# EAGLE design Laser_Terminal (EAGLE 9.2.0)
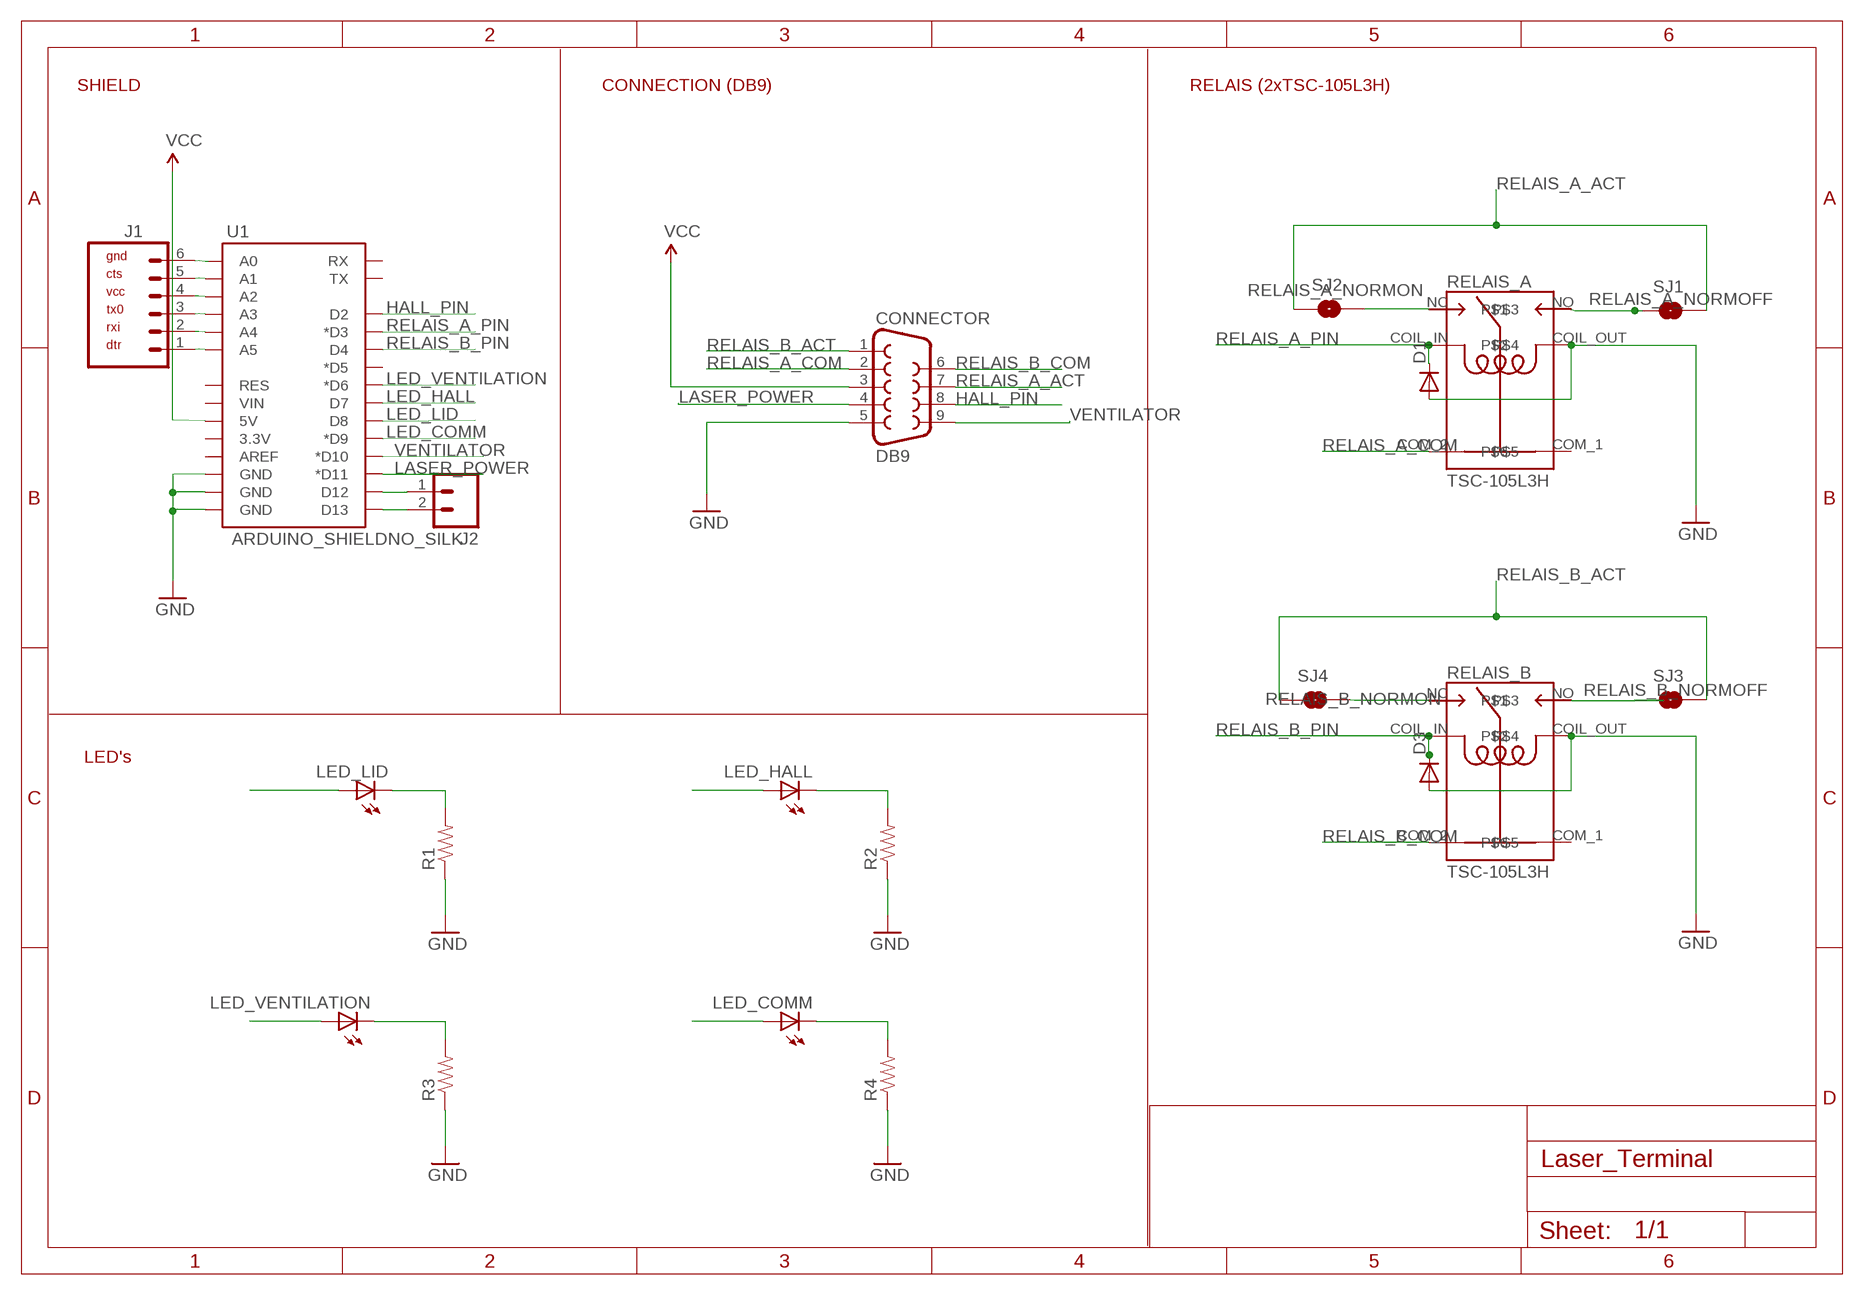
[diagram p0: schematic, sheet 1]

## Parts
CONNECTOR  DB9  DB9MALE  [DB9_MALE]
D1  DIODEPTH  [DIODE-1N4001]
D3  DIODEPTH  [DIODE-1N4001]
J1  M06NO_SILK_YES_STOP  [1X06_NO_SILK_YES_STOP]
J2  M021X02_NO_SILK  [1X02_NO_SILK]
LED_COMM  LED5MM  [LED5MM]
LED_HALL  LED5MM  [LED5MM]
LED_LID  LED5MM  [LED5MM]
LED_VENTILATION  LED5MM  [LED5MM]
R1  RESISTORAXIAL-0.3  [AXIAL-0.3]
R2  RESISTORAXIAL-0.3  [AXIAL-0.3]
R3  RESISTORAXIAL-0.3  [AXIAL-0.3]
R4  RESISTORAXIAL-0.3  [AXIAL-0.3]
RELAIS_A  TSC-105L3H  TSC-112L3H  [TSC_112L3H]
RELAIS_B  TSC-105L3H  TSC-112L3H  [TSC_112L3H]
SJ1  SOLDERJUMPERNO  [SJ_2S-NO]
SJ2  SOLDERJUMPERTRACE  [SJ_2S-TRACE]
SJ3  SOLDERJUMPERNO  [SJ_2S-NO]
SJ4  SOLDERJUMPERTRACE  [SJ_2S-TRACE]
U1  ARDUINO_SHIELDNO_SILK  [DUEMILANOVE_VIAS]

## Nets
GND: CONNECTOR.5 D1.A D3.A R1.P$1 R2.P$1 R3.P$1 R4.P$1 RELAIS_A.COIL_OUT RELAIS_B.COIL_OUT U1.GND@0(GND) U1.GND@1(GND) U1.GND@2(GND)
HALL_PIN: CONNECTOR.8 U1.D2
LASER_POWER: CONNECTOR.4 U1.D11(*D11)
LED_COMM: LED_COMM.A U1.D9(*D9)
LED_HALL: LED_HALL.A U1.D7
LED_LID: LED_LID.A U1.D8
LED_VENTILATION: LED_VENTILATION.A U1.D6(*D6)
N$3: J1.6 U1.A0
N$4: J1.5 U1.A1
N$5: J1.4 U1.A2
N$6: J1.3 U1.A3
N$7: LED_LID.K(C) R1.P$2
N$8: LED_HALL.K(C) R2.P$2
N$9: LED_VENTILATION.K(C) R3.P$2
N$10: LED_COMM.K(C) R4.P$2
N$11: J1.2 U1.A4
N$12: J1.1 U1.A5
N$13: J2.1 U1.D12
N$14: J2.2 U1.D13
RELAIS_A_ACT: CONNECTOR.7 SJ1.2 SJ2.1
RELAIS_A_COM: CONNECTOR.2 RELAIS_A.COM_2
RELAIS_A_NORMOFF: RELAIS_A.NO SJ1.1
RELAIS_A_NORMON: RELAIS_A.NC SJ2.2
RELAIS_A_PIN: D1.C RELAIS_A.COIL_IN U1.D3(*D3)
RELAIS_B_ACT: CONNECTOR.1 SJ3.2 SJ4.1
RELAIS_B_COM: CONNECTOR.6 RELAIS_B.COM_2
RELAIS_B_NORMOFF: RELAIS_B.NO SJ3.1
RELAIS_B_NORMON: RELAIS_B.NC SJ4.2
RELAIS_B_PIN: D3.C RELAIS_B.COIL_IN U1.D4
VCC: CONNECTOR.3 U1.5V
VENTILATOR: CONNECTOR.9 U1.D10(*D10)
Unconnected: RELAIS_A.COM_1 RELAIS_B.COM_1 U1.3.3V U1.AREF U1.D5(*D5) U1.RES U1.RX U1.TX U1.VIN

## Notes on the sheet
- SHIELD | CONNECTION (DB9) | RELAIS (2xTSC-105L3H)
- LED's

## Library data of the parts
CONNECTOR = SparkFun:DB9: DB9 Connector Standard DB9 (D-Sub 9) serial connector. Can be used for CAN bus as well as RS485 and RS232. Footprint production proven. Spark Fun Electronics SKU : PRT-00429
D1 D3 = SparkFun:DIODE: Diode These are standard reverse protection diodes and small signal diodes. SMA package can handle up to about 1A. SOD-323 can handle about 200mA. What the SOD-323 package when ordering, there are some mfgs out there that are 5-pin packages.
J1 = SparkFun-Connectors:M06: Header 6 Standard 6-pin 0.1" header. Use with straight break away headers (SKU : PRT-00116), right angle break away headers (PRT-00553), swiss pins (PRT-00743), machine pins (PRT-00117), and female headers (PRT-00115). Molex polarized connector foot print use with SKU : PRT-08094 with associated crimp pins and housings. NOTES ON THE VARIANTS LOCK and LOCK_LONGPADS... This footprint was designed to help hold the alignment of a through-hole component (i.e. 6-pin header) while soldering it into place. You may notice that each hole has been shifted either up or down by 0.005 of an inch from it's more standard position (which is a perfectly straight line). This slight alteration caused the pins (the squares in the middle) to touch the edges of the holes. Because they are alternating, it causes a "brace" to hold the component in place. 0.005 has proven to be the perfect amount of "off-center" position when using our standard breakaway headers. Although looks a little odd when you look at the bare footprint, once you have a header in there, the alteration is very hard to notice. Also,if you push a header all the way into place, it is covered up entirely on the bottom side. This idea of altering the position of holes to aid alignment will be further integrated into the Sparkfun Library for other footprints. It can help hold any component with 3 or more connection pins.
J2 = SparkFun-Connectors:M02: Standard 2-pin 0.1" header. Use with - straight break away headers ( PRT-00116) - right angle break away headers (PRT-00553) - swiss pins (PRT-00743) - machine pins (PRT-00117) - female headers (PRT-00115) Molex polarized connector foot print use with: PRT-08233 with associated crimp pins and housings. 2.54_SCREWTERM for use with PRT-10571. 3.5mm Screw Terminal footprints for PRT-08084 5mm Screw Terminal footprints for use with PRT-08432
LED_COMM LED_HALL LED_LID LED_VENTILATION = SparkFun:LED: LEDs Standard schematic elements and footprints for 5mm, 3mm, 1206, and 0603 sized LEDs. 5mm - Spark Fun Electronics SKU : COM-00529 (and others)
R1-R4 = SparkFun:RESISTOR: Resistor Basic schematic elements and footprints for 0603, 1206, and PTH resistors.
RELAIS_A RELAIS_B = Custom:TSC-112L3H
SJ1-SJ4 = RP400N501A:SOLDERJUMPER: Solder Jumper Standard SMD solder jumper. Used to automate production. Two varients : Normally Open and Normally Closed are the same, but have different paste layers. NC will have a large amount of paste and should jumper during reflow.
U1 = SparkFun:ARDUINO_SHIELD

## Board
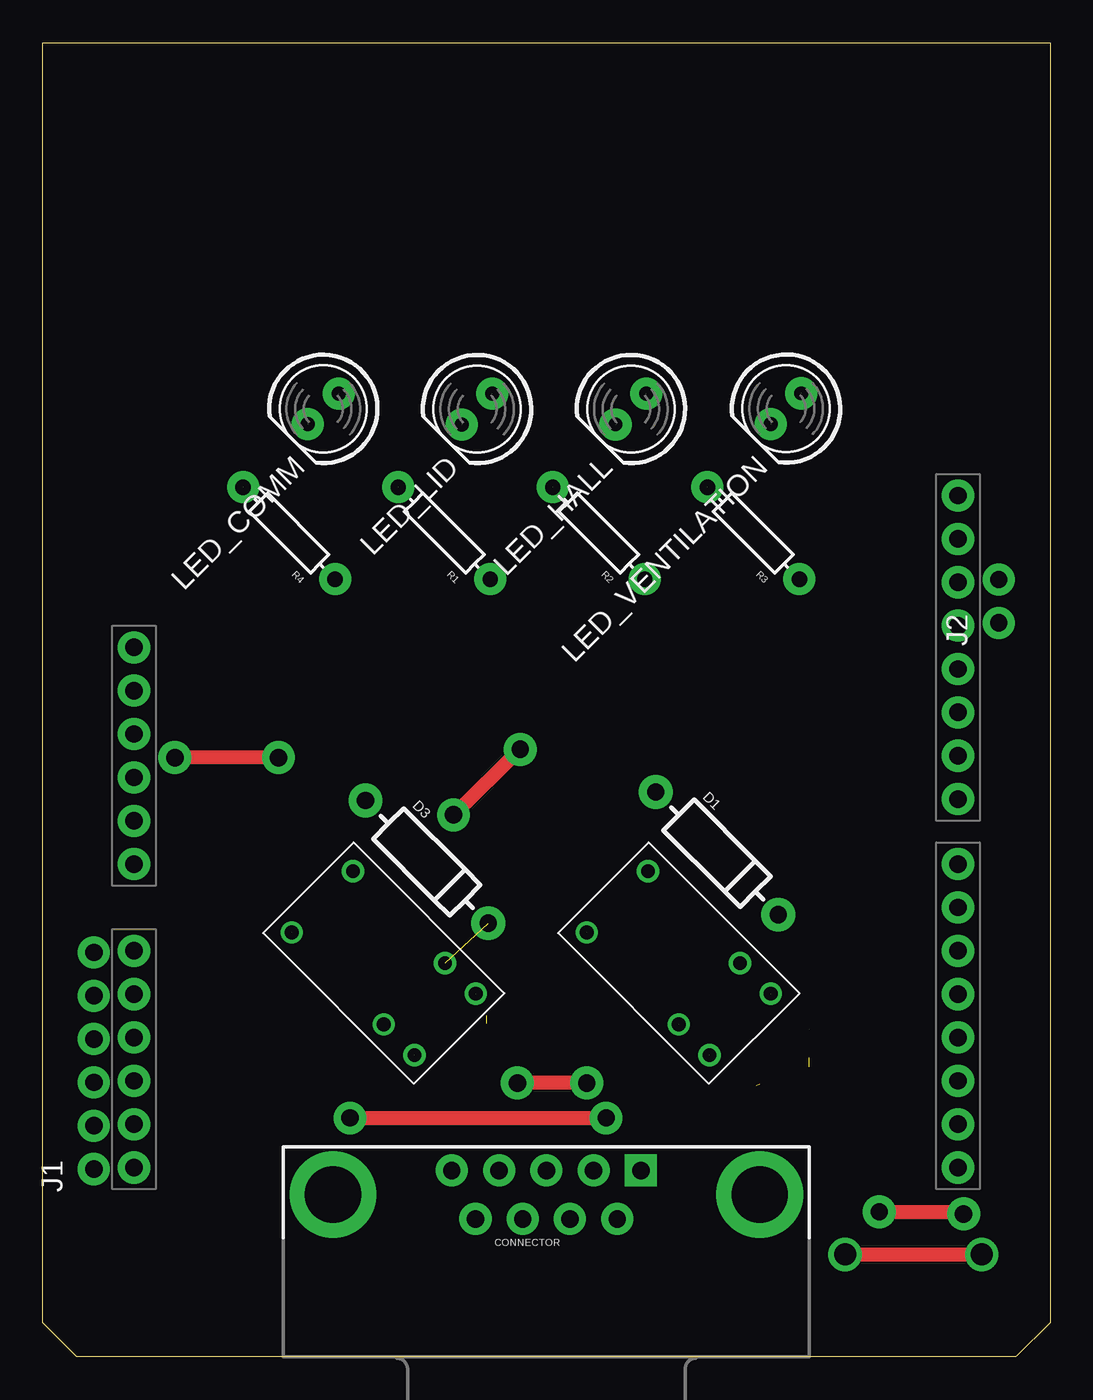
[diagram p1: board, top side]
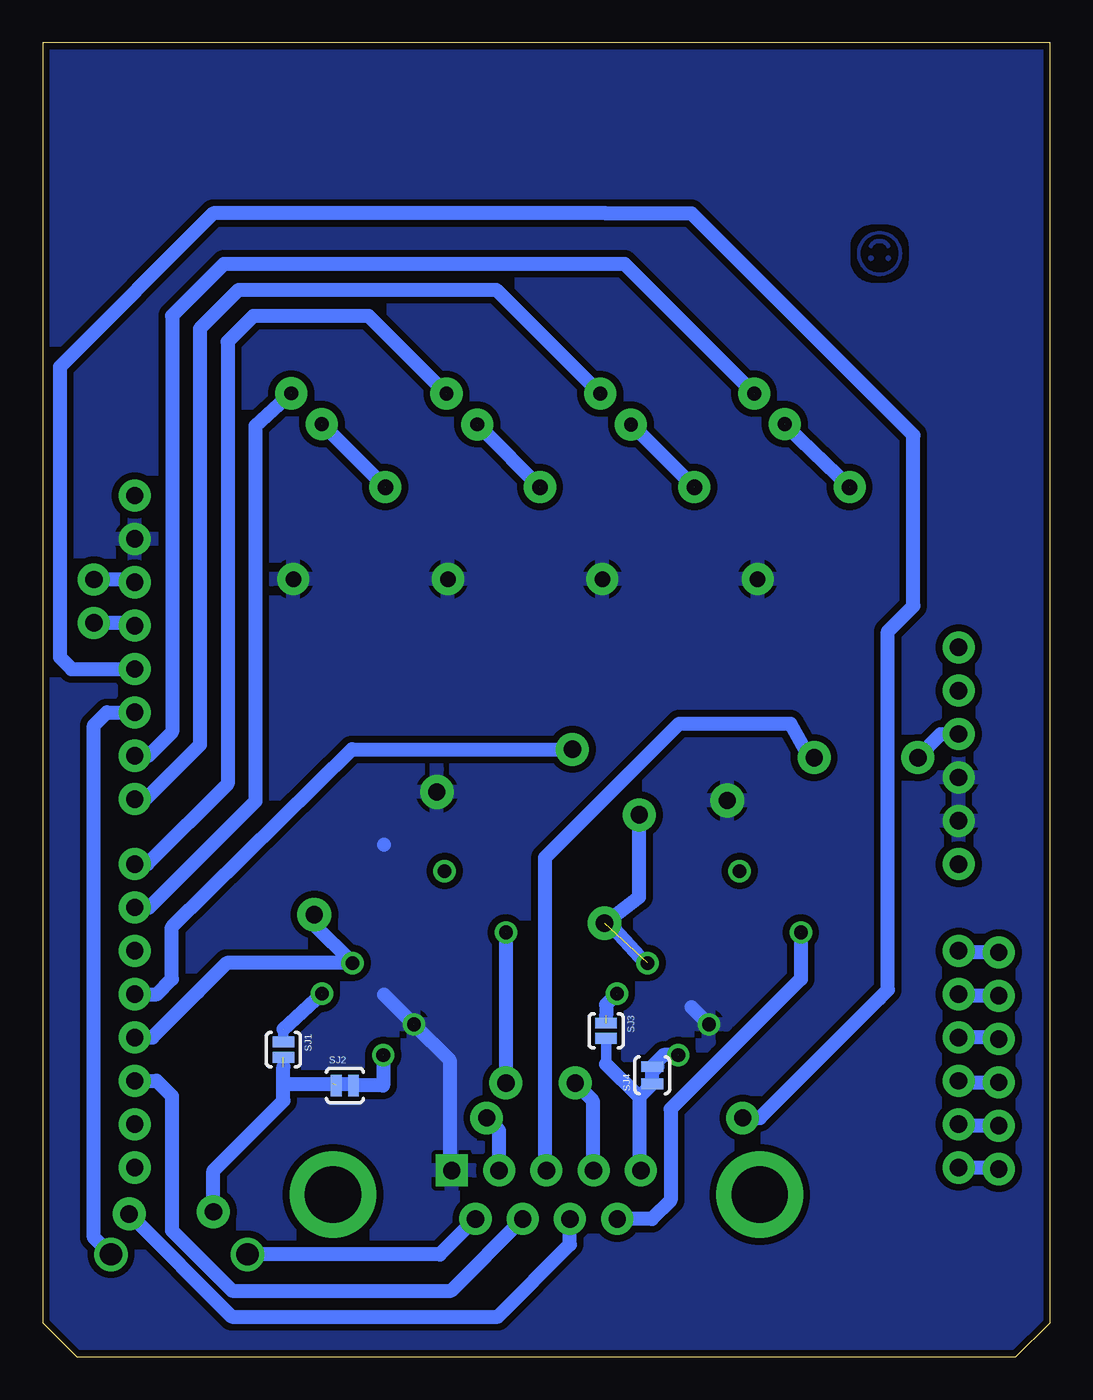
[diagram p2: board, bottom side, seen from below]

Size 59 x 77 mm. Coordinates in mm from the lower left corner, seen from the top.
Outline: 59,2 57,0 2,0 0,2 0,77 59,77 59,2
Copper layers (1*16): Top 0.035mm / dielectric 1.5mm / Bottom 0.035mm
Design rules "SparkFun-2-layer-STANDARD": minimum track width 10mil, minimum drill 20mil, track to track 10mil, track to pad 8mil, pad to pad 8mil, via to via 10mil, smd to smd 8mil, copper to edge 8mil, drill to drill 8mil, minimum pad ring 10mil, minimum via ring 10mil, stop-mask expansion 4mil, vias tented up to drill 25mil, thermal gap 10mil

### Footprints (pad centres in the part's own frame; a part is rotated, then mirrored left to right if it is on the bottom)
DB9_MALE = drill 1.016 pad 1.88: 1 5.54,-1.42; 2 2.77,-1.42; 3 0,-1.42; 4 -2.77,-1.42; 6 4.15,1.42; 7 1.38,1.42; 8 -1.38,1.42; 9 -4.15,1.42 | drill 1.016 pad 1.88 square: 5 -5.54,-1.42 | drill 3.302 pad 5.08: G1 -12.5,0; G2 12.5,0
DIODE-1N4001 = drill 1 pad 1.981: A -5.08,0; C 5.08,0
1X06_NO_SILK_YES_STOP = drill 1.016 pad 1.88: 1 0,0; 2 2.54,0; 3 5.08,0; 4 7.62,0; 5 10.16,0; 6 12.7,0
1X02_NO_SILK = drill 1.016 pad 1.88: 1 0,0; 2 2.54,0
LED5MM = drill 0.813 pad 1.88: A -1.27,0; K 1.27,0
AXIAL-0.3 = drill 0.9 pad 1.88: P$1 -3.81,0; P$2 3.81,0
TSC_112L3H = drill 0.8: COIL_IN 1.21,8.79; COIL_OUT 6.29,8.79; COM_1 1.21,1.17; COM_2 6.29,1.17; NC 6.29,11.33; NO 1.21,11.33
SJ_2S-NO = smd 0.635 x 1.27: 1 -0.45,0; 2 0.45,0
SJ_2S-TRACE = smd 0.635 x 1.27: 1 -0.508,0; 2 0.508,0
DUEMILANOVE_VIAS = drill 1.016 pad 1.88: 3.3V 50.8,13.97; 5V 50.8,16.51; A0 50.8,29.21; A1 50.8,31.75; A2 50.8,34.29; A3 50.8,36.83; A4 50.8,39.37; A5 50.8,41.91; AREF 2.54,2.54; D2 2.54,36.83; D3 2.54,34.29; D4 2.54,31.75; D5 2.54,29.21; D6 2.54,26.67; D7 2.54,24.13; D8 2.54,20.32; D9 2.54,17.78; D10 2.54,15.24; D11 2.54,12.7; D12 2.54,10.16; D13 2.54,7.62; GND@0 50.8,19.05; GND@1 50.8,21.59; GND@2 2.54,5.08; RES 50.8,11.43; RX 2.54,41.91; TX 2.54,39.37; VIN 50.8,24.13

### Placement (x,y rotation side)
CONNECTOR  29.5,9.5 180 top
D1  39.5,29.5 315 top
D3  22.5,29 315 top
J1  3,11 90 top
J2  56,43 90 top
LED_COMM  16.43,55.54 225 top
LED_HALL  34.45,55.53 225 top
LED_LID  25.44,55.53 225 top
LED_VENTILATION  43.54,55.56 225 top
R1  23.52,48.26 135 top
R2  32.57,48.26 135 top
R3  41.62,48.26 135 top
R4  14.43,48.26 135 top
RELAIS_A  35.49,30.14 225 top
RELAIS_B  18.21,30.14 225 top
SJ1  44.9,18 270 bottom
SJ2  41.3,15.9 0 bottom
SJ3  26,19.1 270 bottom
SJ4  23.3,16.5 90 bottom
U1  56.15,53 180 top

### Tracks (layer width: path | path; a pad name or v marks a point on that pad's centre or on a via)
GND  (1 unrouted)
  Bottom 0.813: RELAIS_A.COIL_OUT 37.26,19.4 | CONNECTOR.5 35.17,11.05 35.17,17.39 RELAIS_A.COIL_OUT | RELAIS_A.COIL_OUT 39,21.22 | RELAIS_B.COIL_OUT 21,20.5 | 39,30
  pour Bottom (isolate 0.4, rank 3): 57,0 0,0 0,77 59,77 59,0
HALL_PIN
  Bottom 0.813: U1.D2 52.32,16.17 51.43,15.28 51.43,7.4 47.9,3.88 35.08,3.88 CONNECTOR.8
LASER_POWER  (via drill 1 pad 1.9)
  Top 0.813: v18,14 v33,14
  Bottom 0.813: CONNECTOR.4 32.27,13.27 v33,14 | v18,14 17,14 10,21 9.5,21.5 9.5,42.5 8,44 8,54 9.5,55.5 21,67 26,67 49,67 58,58 58,41 57.3,40.3 U1.D11
LED_COMM  (1 unrouted)
  Bottom 0.813: U1.D9 52.81,35.22 51.42,36.61 51.42,61 48.37,64.05 24.94,64.05 LED_COMM.A
LED_HALL  (1 unrouted)
  Bottom 0.813: U1.D7 52.87,28.87 48.17,33.57 48.17,59.47 46.65,61 39.92,61 LED_HALL.A
LED_LID  (1 unrouted)
  Bottom 0.813: U1.D8 52.97,32.68 49.8,35.85 49.8,60.24 47.51,62.52 32.43,62.52 LED_LID.A
LED_VENTILATION  (1 unrouted)
  Bottom 0.813: U1.D6 52.77,26.33 46.55,32.55 46.55,54.55 LED_VENTILATION.A
N$2
  Bottom 0.813: 23.57,23.07 23.71,23.07 26.13,25.74
N$3
  Bottom 0.813: J1.6 5.26,23.7 U1.A0
N$4
  Bottom 0.813: J1.5 5.26,21.16 U1.A1
N$5
  Bottom 0.813: J1.4 3.09,18.71 U1.A2
N$6
  Bottom 0.813: U1.A3 5.26,16.08 J1.3
N$7  (2 unrouted)
  Bottom 0.813: LED_LID.K 24.38,54.51 R1.P$2
N$8  (2 unrouted)
  Bottom 0.813: LED_HALL.K 33.3,54.38 R2.P$2
N$9  (2 unrouted)
  Bottom 0.813: LED_VENTILATION.K 42.38,54.4 R3.P$2
N$10  (2 unrouted)
  Bottom 0.813: LED_COMM.K 15.41,54.5 R4.P$2
N$11
  Bottom 0.813: J1.2 5.26,13.54 U1.A4
N$12
  Bottom 0.813: U1.A5 3.09,11.09 J1.1
N$13
  Bottom 0.813: U1.D12 53.77,43 J2.1
N$14
  Bottom 0.813: U1.D13 53.77,45.54 J2.2
RELAIS_A_ACT  (via drill 1.02 pad 1.93)  (2 unrouted)
  Top 0.813: v49,8.5 53.81,8.5 v53.94,8.37
  Bottom 0.813: CONNECTOR.7 28.12,6.58 32.35,2.36 47.92,2.36 v53.94,8.37 | 44.9,16 44.9,15 49,10.9 v49,8.5 | 44.9,16 42,16 | 44.9,16 44.9,17 | SJ2.1 41.71,16 41,16
RELAIS_A_COM  (via drill 1.02 pad 1.93)  (1 unrouted)
  Top 0.813: v31.87,16.04 | v31.87,16.04 v27.81,16.04
  Bottom 0.813: RELAIS_A.COM_2 v31.87,16.04 | v27.81,16.04 26.79,15.02 26.79,10.98 CONNECTOR.2
RELAIS_A_NORMOFF  (2 unrouted)
  Bottom 0.61: 44.73,19.36 44.9,19.19 SJ1.1
  Bottom 0.813: RELAIS_A.NO 44.9,19.2
RELAIS_A_NORMON  (1 unrouted)
  Bottom 0.813: RELAIS_A.NC 39.05,15.9 SJ2.2
RELAIS_A_PIN
  Bottom 0.813: U1.D3 52.57,18.71 49.9,21.37 48.21,23.07 RELAIS_A.COIL_IN 43.09,25.31 D1.C
RELAIS_B_ACT
  Bottom 0.61: 26,17.15 SJ3.2
  Bottom 0.813: CONNECTOR.1 24.07,10.96 24.07,15.22 | 24.07,15.22 SJ4.1 23.3,16.7 23,17 | 24.07,15.22 26,17.15
RELAIS_B_COM  (1 unrouted)
  Bottom 0.813: CONNECTOR.6 23.32,8.08 22.22,9.18 22.22,14.52 14.6,22.14 RELAIS_B.COM_2
RELAIS_B_NORMOFF  (2 unrouted)
  Bottom 0.813: RELAIS_B.NO 26,20.64 26,20
RELAIS_B_NORMON  (1 unrouted)
  Bottom 0.813: RELAIS_B.NC 22.63,17.68 SJ4.2
RELAIS_B_PIN  (via drill 1.02 pad 1.93)  (1 unrouted)
  Top 0.813: v27.97,35.6 v24.06,31.76
  Bottom 0.813: U1.D4 52.31,21.25 51.43,22.14 51.43,25.18 40.89,35.6 v27.97,35.6 | D3.C 24.06,26.94 v24.06,31.76
TEST
  pour Bottom (no thermals): 9.98,65.29 10.13,65.27 10.26,65.22 10.37,65.13 10.46,65 10.49,65.01 10.53,65.03 10.56,65.05 10.59,65.07 10.53,65.16 10.47,65.24 10.41,65.31 10.34,65.37 10.26,65.41 10.17,65.45 10.08,65.47 9.98,65.47 9.88,65.47 9.79,65.45 9.71,65.41 9.63,65.37 9.56,65.31 9.49,65.24 9.43,65.16 9.37,65.07 9.41,65.05 9.44,65.03 9.47,65.01 9.5,65 9.59,65.13 9.7,65.22 9.83,65.27
  pour Bottom (no thermals): 10.37,64.49 10.33,64.44 10.32,64.37 10.33,64.31 10.37,64.25 10.42,64.22 10.49,64.21 10.55,64.22 10.61,64.25 10.64,64.31 10.66,64.37 10.64,64.44 10.61,64.49 10.55,64.53 10.49,64.54 10.42,64.53
  pour Bottom (no thermals): 9.05,63.71 9.14,63.63 9.24,63.55 9.35,63.49 9.45,63.44 9.56,63.39 9.68,63.36 9.8,63.34 9.93,63.33 9.93,63.36 9.93,63.38 9.93,63.4 9.93,63.43 9.93,63.45 9.93,63.48 9.93,63.5 9.93,63.52 9.82,63.53 9.72,63.55 9.62,63.58 9.53,63.61 9.43,63.66 9.35,63.71 9.26,63.78 9.18,63.85 9.11,63.93 9.04,64.02 8.98,64.12 8.94,64.21 8.9,64.32 8.88,64.42 8.86,64.53 8.86,64.65 8.86,64.76 8.88,64.87 8.9,64.98 8.94,65.08 8.98,65.17 9.04,65.27 9.11,65.36 9.18,65.44 9.27,65.52 9.36,65.59 9.45,65.64 9.55,65.69 9.65,65.72 9.76,65.75 9.87,65.77 9.98,65.77 10.1,65.77 10.21,65.75 10.31,65.72 10.41,65.69 10.51,65.64 10.61,65.59 10.69,65.52 10.78,65.44 10.86,65.36 10.92,65.27 10.98,65.17 11.03,65.08 11.06,64.98 11.09,64.87 11.1,64.76 11.11,64.65 11.1,64.53 11.09,64.42 11.06,64.32 11.03,64.21 10.98,64.12 10.92,64.02 10.86,63.93 10.78,63.85 10.69,63.77 10.61,63.7 10.51,63.65 10.41,63.6 10.31,63.57 10.21,63.54 10.1,63.52 9.98,63.52 9.98,63.52 9.97,63.52 9.96,63.52 9.96,63.52 9.95,63.52 9.94,63.52 9.94,63.52 9.93,63.52 9.93,63.5 9.93,63.48 9.93,63.45 9.93,63.43 9.93,63.4 9.93,63.38 9.93,63.36 9.93,63.33 9.94,63.33 9.94,63.33 9.95,63.33 9.96,63.33 9.96,63.33 9.97,63.33 9.98,63.33 9.98,63.33 10.12,63.33 10.24,63.35 10.37,63.38 10.49,63.42 10.6,63.48 10.71,63.54 10.81,63.62 10.91,63.71 11,63.81 11.08,63.92 11.15,64.02 11.2,64.14 11.25,64.26 11.28,64.38 11.29,64.51 11.3,64.65 11.29,64.78 11.28,64.91 11.25,65.03 11.2,65.15 11.15,65.27 11.08,65.37 11,65.48 10.91,65.58 10.81,65.67 10.71,65.75 10.6,65.81 10.49,65.87 10.37,65.91 10.24,65.94 10.12,65.96 9.98,65.96 9.85,65.96 9.72,65.94 9.59,65.91 9.48,65.87 9.36,65.81 9.25,65.75 9.15,65.67 9.05,65.58 8.96,65.48 8.88,65.37 8.82,65.27 8.76,65.15 8.72,65.03 8.69,64.91 8.67,64.78 8.66,64.65 8.67,64.51 8.69,64.38 8.72,64.26 8.76,64.14 8.82,64.02 8.88,63.92 8.96,63.81
  pour Bottom (no thermals): 9.48,64.54 9.41,64.53 9.36,64.49 9.32,64.44 9.31,64.37 9.32,64.31 9.36,64.25 9.41,64.22 9.48,64.21 9.54,64.22 9.6,64.25 9.63,64.31 9.64,64.37 9.63,64.44 9.6,64.49 9.54,64.53
VCC  (via drill 1.02 pad 1.93)
  Top 0.813: v13.81,35.11 v7.74,35.11
  Bottom 0.813: U1.5V 6.4,36.49 v7.74,35.11 | CONNECTOR.3 29.58,11.13 29.58,29.23 21.71,37.11 15.2,37.1 14.11,35.11 v13.81,35.11
VENTILATOR  (via drill 1.3)
  Top 0.813: v47,6 v55,6
  Bottom 0.813: CONNECTOR.9 35.73,6 v47,6 | v55,6 56,7 56,37 55.24,37.76 U1.D10